# Altium schematic sheet AnalogSigCond1.SchDoc: Analog Signal Front-End 1
size Letter; Engineer: Nathan Petersen; DocumentNumber: 14; Revision: v1.2; SheetNumber: 14; SheetTotal: 30
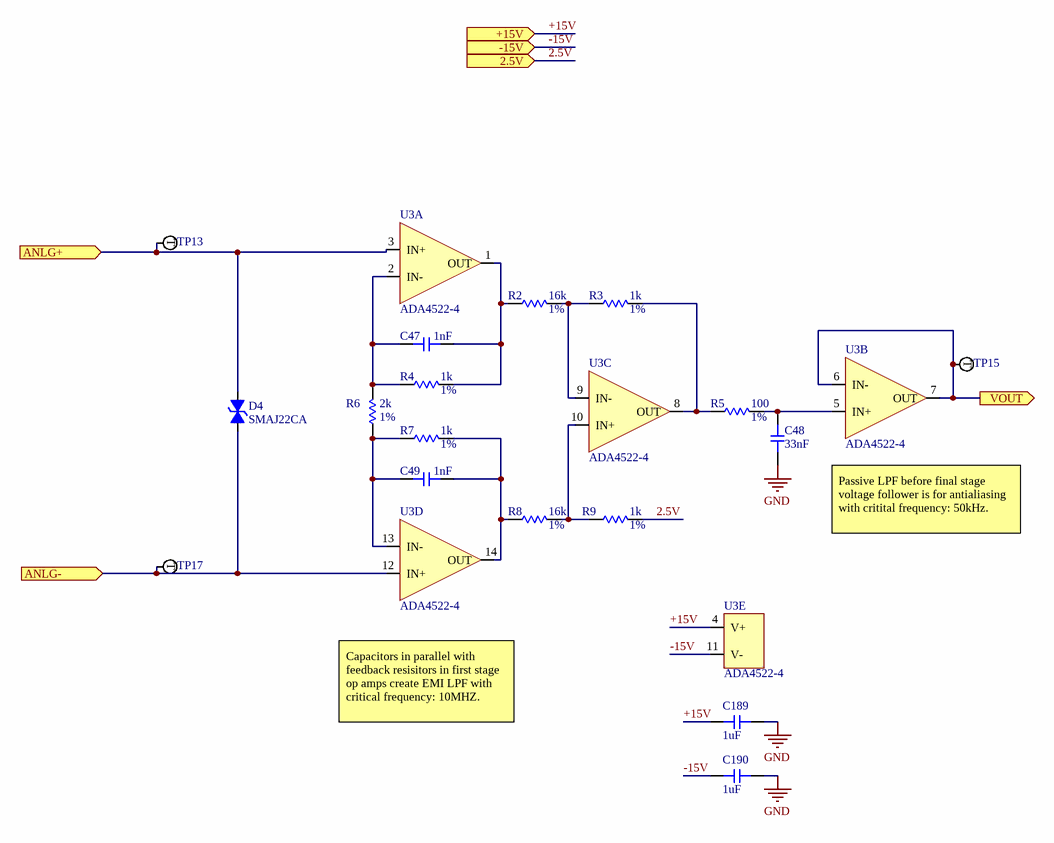
[diagram p0: AnalogSigCond1.SchDoc]

## Parts
C47  Capacitance: 1nF  [0603-CAP]  (hidden comment: Capacitor)
C48  Capacitance: 33nF  [0603-CAP]  (hidden comment: Capacitor)
C49  Capacitance: 1nF  [0603-CAP]  (hidden comment: Capacitor)
C189  value 1uF  [0603-CAP]  (hidden comment: Capacitor)
C190  value 1uF  [0603-CAP]  (hidden comment: Capacitor)
D4  Manufacturer Part Number: SMAJ22CA  [SMA]  (hidden comment: TVS SMAJ22CA)
R2  Resistance: 16k  Tolerance: 1%  [0603-RES]  (hidden comment: Resistor)
R3  Resistance: 1k  Tolerance: 1%  [0603-RES]  (hidden comment: Resistor)
R4  Resistance: 1k  Tolerance: 1%  [0603-RES]  (hidden comment: Resistor)
R5  Resistance: 100  Tolerance: 1%  [0603-RES]  (hidden comment: Resistor)
R6  Resistance: 2k  Tolerance: 1%  [0603-RES]  (hidden comment: Resistor)
R7  Resistance: 1k  Tolerance: 1%  [0603-RES]  (hidden comment: Resistor)
R8  Resistance: 16k  Tolerance: 1%  [0603-RES]  (hidden comment: Resistor)
R9  Resistance: 1k  Tolerance: 1%  [0603-RES]  (hidden comment: Resistor)
TP13  Test Point  [RCU-0C]  (value not drawn)
TP15  Test Point  [RCU-0C]  (value not drawn)
TP17  Test Point  [RCU-0C]  (value not drawn)
U3  ADA4522-4  [TSSOP-14]  (parts A,B,C,D,E of 5)

## Ports
2.5V (in), +15V (in), -15V (in), ANLG+ (in), ANLG- (in), VOUT (out)

## Nets
GND: C48.1 C189.2 C190.2
2.5V: R9.2 ; port 2.5V
+15V: C189.1 U3.4(V+) ; port +15V
-15V: C190.1 U3.11(V-) ; port -15V
ANLG+: D4.2 TP13.1 U3.3(IN+) ; port ANLG+
ANLG-: D4.1 TP17.1 U3.12(IN+) ; port ANLG-
VOUT: TP15.1 U3.6(IN-) U3.7(OUT) ; port VOUT
NetC47_1: C47.1 R4.1 R6.2 U3.2(IN-)
NetC47_2: C47.2 R2.1 R4.2 U3.1(OUT)
NetC48_2: C48.2 R5.2 U3.5(IN+)
NetC49_1: C49.1 R6.1 R7.1 U3.13(IN-)
NetC49_2: C49.2 R7.2 R8.1 U3.14(OUT)
NetR2_2: R2.2 R3.1 U3.9(IN-)
NetR3_2: R3.2 R5.1 U3.8(OUT)
NetR8_2: R8.2 R9.1 U3.10(IN+)

## Notes on the sheet
- Passive LPF before final stage voltage follower is for antialiasing with critital frequency: 50kHz.
- Capacitors in parallel with feedback resisitors in first stage op amps create EMI LPF with critical frequency: 10MHZ.
- Title:
- File:
- Sheet:
- of
- Revision:
- Time:
- Date:
- Engineer:
- (in symbol Test Point) T

## Library data of the parts
C47 C49 = Capacitor: Manufacturer: KEMET; Manufacturer Part Number: C0603C102J5RAC7867; Dielectric Material: Ceramic; Tolerance: 5%; Dielectric: X7R; Voltage Rating (DC): 50V; Supplier 1: Digi-Key; Supplier Part Number 1: 399-1083-6-ND; Stock 1: 40000; Pricing 1: 1=0.1, 10=0.051, 100=0.0225, 500=0.0161, 1000=0.01265 (USD); Mount: Surface Mount; Case/Package: 0603; Min Operating Temperature: -55°C; Max Operating Temperature: 125°C; Packaging: Tape and Reel; Length: 1.6mm; Height: 0.8mm; Depth: 0.8mm; Radiation Hardening: No; ComponentLink1URL: https://datasheet.ciiva.com/45846/docfinderpartnumberc0402c102k5ractu-45846924.pdf; ComponentLink1Description: https://datasheet.ciiva.com/45846/docfinderpartnumberc0402c102k5ractu-45846924.pdf
C48 = Capacitor: Manufacturer: Samsung; Manufacturer Part Number: CL10B333KA8NNNC; Tolerance: 10%; Voltage Rating: 25V; Dielectric: X7R; Supplier 1: Digi-Key; Supplier Part Number 1: 1276-2038-6-ND; Stock 1: 40000; Pricing 1: 1=0.1, 10=0.051, 100=0.0225, 500=0.0161, 1000=0.01265 (USD); Mount: Surface Mount; Case/Package: 0603; Case Code (Metric): 1608; Case Code (Imperial): 0603; Min Operating Temperature: -55°C; Max Operating Temperature: 125°C; Package Quantity: 1; Packaging: Tape and Reel; Voltage Rating (DC): 25V; Length: 1.6mm; Height: 0.8mm; Width: 0.031inch; Thickness: 0.035inch; Depth: 0.8mm; Radiation Hardening: No; Lead Free: Lead Free; ComponentLink1URL: https://datasheet.ciiva.com/25781/cl10b333ka8nnnc-25781520.pdf; ComponentLink1Description: https://datasheet.ciiva.com/25781/cl10b333ka8nnnc-25781520.pdf; ComponentLink2URL: https://datasheet.ciiva.com/16218/cl05b104kq5nnnc-16218987.pdf; ComponentLink2Description: https://datasheet.ciiva.com/16218/cl05b104kq5nnnc-16218987.pdf; ComponentLink3URL: https://datasheet.ciiva.com/26838/getdatasheetpartid-745367-26838459.pdf; ComponentLink3Description: https://datasheet.ciiva.com/26838/getdatasheetpartid-745367-26838459.pdf
C189 C190 = Capacitor: Manufacturer: Samsung; Manufacturer Part Number: CL10B105MO8NNWC; Voltage Rating: 16V; Tolerance: 20%; Supplier 1: Digi-Key; Supplier Part Number 1: 1276-6524-6-ND; Stock 1: 40000; Pricing 1: 1=0.1, 10=0.032, 100=0.0142, 500=0.01016, 1000=0.00798 (USD); Mount: Surface Mount; Case/Package: 0603; Case Code (Metric): 1608; Case Code (Imperial): 0603; Min Operating Temperature: -55°C; Max Operating Temperature: 125°C; Packaging: Tape and Reel; Capacitance: 1uF; Length: 0.063inch; Width: 0.031inch; Thickness: 0.035inch; ComponentLink1URL: http://www.samsungsem.com/kr/support/product-search/mlcc/CL10B105MO8NNWC.jsp; ComponentLink1Description: http://www.samsungsem.com/kr/support/product-search/mlcc/CL10B105MO8NNWC.jsp
D4 = TVS SMAJ22CA: TVS DIODE 22V 35.5V SMA; Manufacturer: Bourns; Direction: Bidirectional; Reverse Breakdown Voltage: 24.4V; Operating Supply Voltage: 3.5V; Max Surge Current: 40A; Number of Bidirectional Channels: 1; Peak Pulse Power: 400W; Power Line Protection: No; Breakdown Voltage: 26.9V; Peak Pulse Current: 11.2A; Test Current: 1mA; Max Reverse Leakage Current: 5uA; Element Configuration: Single; ComponentLink1URL: https://datasheet.ciiva.com/333/smaj-333520.pdf; ComponentLink1Description: https://datasheet.ciiva.com/333/smaj-333520.pdf; ComponentLink2URL: https://datasheet.ciiva.com/3022/smaj-3022225.pdf; ComponentLink2Description: https://datasheet.ciiva.com/3022/smaj-3022225.pdf; ComponentLink3URL: https://datasheet.ciiva.com/17413/smaj-17413512.pdf; ComponentLink3Description: https://datasheet.ciiva.com/17413/smaj-17413512.pdf; ComponentLink4URL: https://datasheet.ciiva.com/4509/smaj-74970-4509930.pdf; ComponentLink4Description: https://datasheet.ciiva.com/4509/smaj-74970-4509930.pdf; ComponentLink5URL: https://datasheet.ciiva.com/333/smaj-333518.pdf; ComponentLink5Description: https://datasheet.ciiva.com/333/smaj-333518.pdf; ComponentLink6URL: https://datasheet.ciiva.com/333/smaj-333519.pdf; ComponentLink6Description: https://datasheet.ciiva.com/333/smaj-333519.pdf; Supplier 1: Digi-Key; Stock 1: 24429; Pricing 1: 1=0.45, 10=0.353, 25=0.2976, 100=0.2421, 250=0.2006, 500=0.16602, 1000=0.12451, 2500=0.11414 (USD); Mount: Surface Mount; Case/Package: SMA; Number of Pins: 2; Min Operating Temperature: -55°C; Max Operating Temperature: 150°C; Packaging: Tape and Reel; Package Quantity: 1; Reverse Standoff Voltage: 22V; Min Breakdown Voltage: 24.4V; Clamping Voltage: 35.5V; Number of Channels: 1; Polarity: Bidirectional; Termination: SMD/SMT; Number of Elements: 1; Leakage Current: 5uA; Composition: Zener; Radiation Hardening: No; ComponentLink7URL: https://datasheet.ciiva.com/3022/smaj-3022227.pdf; ComponentLink7Description: https://datasheet.ciiva.com/3022/smaj-3022227.pdf; ComponentLink8URL: https://datasheet.ciiva.com/3022/smaj-3022228.pdf; ComponentLink8Description: https://datasheet.ciiva.com/3022/smaj-3022228.pdf; ComponentLink9URL: https://datasheet.ciiva.com/334/smaj-334501.pdf; ComponentLink9Description: https://datasheet.ciiva.com/334/smaj-334501.pdf; ComponentLink10URL: https://datasheet.ciiva.com/334/smaj-334502.pdf; ComponentLink10Description: https://datasheet.ciiva.com/334/smaj-334502.pdf; ComponentLink11URL: https://datasheet.ciiva.com/334/smaj-334503.pdf; ComponentLink11Description: https://datasheet.ciiva.com/334/smaj-334503.pdf; Supplier Part Number 1: SMAJ22CABDKR-ND
R2 R8 = Resistor: Manufacturer: Panasonic; Manufacturer Part Number: ERJ-3EKF1602V; Power Rating: 100mW; Voltage Rating: 75V; Temperature Coefficient: 100ppm/°C; Supplier 1: Digi-Key; Supplier Part Number 1: P16.0KHDKR-ND; Stock 1: 80279; Pricing 1: 1=0.1, 10=0.079, 100=0.0323, 1000=0.01449, 2500=0.01258 (USD); Mount: Surface Mount; Case/Package: 0603; Case Code (Imperial): 0603; Case Code (Metric): 1608; Contact Plating: Tin; Min Operating Temperature: -55°C; Max Operating Temperature: 155°C; Packaging: Tape and Reel; Package Quantity: 1; Composition: Thick Film; Number of Terminations: 2; Military Standard: Not; Termination: SMD/SMT; Max Power Dissipation: 100mW; Voltage Rating (DC): 75V; Features: Automotive AEC-Q200; Length: 1.6mm; Height: 0.022inch; Width: 0.8mm; Depth: 0.8mm; Radiation Hardening: No; REACH SVHC: Unknown; Lead Free: Lead Free; ComponentLink1URL: https://datasheet.ciiva.com/28680/1678782-28680759.pdf; ComponentLink1Description: https://datasheet.ciiva.com/28680/1678782-28680759.pdf; ComponentLink2URL: https://datasheet.ciiva.com/16779/70260748-16779769.pdf; ComponentLink2Description: https://datasheet.ciiva.com/16779/70260748-16779769.pdf; ComponentLink3URL: https://datasheet.ciiva.com/30226/aoa0000ce2-30226189.pdf; ComponentLink3Description: https://datasheet.ciiva.com/30226/aoa0000ce2-30226189.pdf; ComponentLink4URL: https://datasheet.ciiva.com/5875/426256-5875646.pdf; ComponentLink4Description: https://datasheet.ciiva.com/5875/426256-5875646.pdf; ComponentLink5URL: https://datasheet.ciiva.com/28515/1678782-28515247.pdf; ComponentLink5Description: https://datasheet.ciiva.com/28515/1678782-28515247.pdf; ComponentLink6URL: https://datasheet.ciiva.com/46378/426256-46378047.pdf; ComponentLink6Description: https://datasheet.ciiva.com/46378/426256-46378047.pdf
R3 R4 R7 R9 = Resistor: Manufacturer: Panasonic; Manufacturer Part Number: ERJ-3EKF1001V; Power Rating: 100mW; Voltage Rating: 75V; Temperature Coefficient: 100ppm/°C; Supplier 1: Digi-Key; Supplier Part Number 1: P1.00KHDKR-ND; Stock 1: 16711563; Pricing 1: 1=0.1, 10=0.079, 100=0.0323, 1000=0.01449, 2500=0.01258 (USD); Mount: Surface Mount; Case/Package: 0603; Number of Pins: 2; Case Code (Metric): 1608; Case Code (Imperial): 0603; Contact Plating: Tin; Min Operating Temperature: -55°C; Max Operating Temperature: 155°C; Packaging: Tape and Reel; Composition: Thick Film; Military Standard: Not; Voltage Rating (DC): 75V; Package Quantity: 1; Number of Terminations: 2; Termination: SMD/SMT; Max Power Dissipation: 100mW; Features: Automotive AEC-Q200; Length: 1.6mm; Height: 0.45mm; Width: 0.031inch; Depth: 0.8mm; Radiation Hardening: No; REACH SVHC: No SVHC; Lead Free: Lead Free; ComponentLink1URL: https://datasheet.ciiva.com/16768/70260748-16768437.pdf; ComponentLink1Description: https://datasheet.ciiva.com/16768/70260748-16768437.pdf; ComponentLink2URL: https://datasheet.ciiva.com/16774/70260748-16774550.pdf; ComponentLink2Description: https://datasheet.ciiva.com/16774/70260748-16774550.pdf; ComponentLink3URL: https://datasheet.ciiva.com/28532/426256-28532120.pdf; ComponentLink3Description: https://datasheet.ciiva.com/28532/426256-28532120.pdf; ComponentLink4URL: https://datasheet.ciiva.com/16449/aoa0000ce2-16449065.pdf; ComponentLink4Description: https://datasheet.ciiva.com/16449/aoa0000ce2-16449065.pdf; ComponentLink5URL: https://datasheet.ciiva.com/7942/aoa0000ce2-7942427.pdf; ComponentLink5Description: https://datasheet.ciiva.com/7942/aoa0000ce2-7942427.pdf; ComponentLink6URL: https://datasheet.ciiva.com/9198/aoa0000ce2-9198923.pdf; ComponentLink6Description: https://datasheet.ciiva.com/9198/aoa0000ce2-9198923.pdf; ComponentLink7URL: https://datasheet.ciiva.com/46373/1678782-46373339.pdf; ComponentLink7Description: https://datasheet.ciiva.com/46373/1678782-46373339.pdf; ComponentLink8URL: https://datasheet.ciiva.com/48530/aoa0000ce2-48530987.pdf; ComponentLink8Description: https://datasheet.ciiva.com/48530/aoa0000ce2-48530987.pdf; ComponentLink9URL: https://datasheet.ciiva.com/46373/1678782-46373340.pdf; ComponentLink9Description: https://datasheet.ciiva.com/46373/1678782-46373340.pdf; ComponentLink10URL: https://datasheet.ciiva.com/24070/aoa0000ce2-24070269.pdf; ComponentLink10Description: https://datasheet.ciiva.com/24070/aoa0000ce2-24070269.pdf; ComponentLink11URL: https://datasheet.ciiva.com/22673/1678782-22673918.pdf; ComponentLink11Description: https://datasheet.ciiva.com/22673/1678782-22673918.pdf; ComponentLink12URL: https://datasheet.ciiva.com/30063/aoa0000ce2-30063390.pdf; ComponentLink12Description: https://datasheet.ciiva.com/30063/aoa0000ce2-30063390.pdf; ComponentLink13URL: https://datasheet.ciiva.com/17215/aoa0000ce2-17215311.pdf; ComponentLink13Description: https://datasheet.ciiva.com/17215/aoa0000ce2-17215311.pdf
R5 = Resistor: Manufacturer: Yageo; Manufacturer Part Number: AC0603FR-07100RL; Power Rating: 100mW; Voltage Rating: 50V; Temperature Coefficient: 100ppm/°C; Supplier 1: Digi-Key; Supplier Part Number 1: YAG3561DKR-ND; Stock 1: 161909; Pricing 1: 1=0.1, 10=0.032, 100=0.0129, 1000=0.00579, 2500=0.00502 (USD); Case/Package: 0603; Weight: 7.1E-05oz; Case Code (Imperial): 0603; Case Code (Metric): 1608; Contact Plating: Tin,Matte; Min Operating Temperature: -55°C; Max Operating Temperature: 155°C; Packaging: Tape and Reel; Composition: Thick Film; Number of Terminations: 2; Termination: SMD/SMT; Military Standard: Not; Max Power Dissipation: 100mW; Length: 1.6mm; Height: 0.022inch; Width: 0.031inch; Depth: 0.8mm; Radiation Hardening: No; Lead Free: Lead Free; ComponentLink1URL: https://datasheet.ciiva.com/12576/pyu-ac-51-rohs-l-2-12576586.pdf; ComponentLink1Description: https://datasheet.ciiva.com/12576/pyu-ac-51-rohs-l-2-12576586.pdf
R6 = Resistor: Manufacturer: Samsung; Manufacturer Part Number: RC1608F202CS; Max Power Dissipation: 100mW; Temperature Coefficient: 100ppm/°C; Voltage Rating (DC): 50V; Supplier 1: Digi-Key; Supplier Part Number 1: 1276-3495-6-ND; Stock 1: 137995; Pricing 1: 1=0.1, 10=0.033, 100=0.0136, 1000=0.00609, 2500=0.00529 (USD); Case/Package: 0603; Case Code (Metric): 1608; Case Code (Imperial): 0603; Contact Plating: Tin; Min Operating Temperature: -55°C; Max Operating Temperature: 155°C; Packaging: Tape and Reel; Composition: Thick Film; Number of Terminations: 2; Military Standard: Not; Length: 0.063inch; Height: 0.022inch; Width: 0.031inch; Depth: 0.8mm; Radiation Hardening: No; Lead Free: Lead Free; ComponentLink1URL: https://datasheet.ciiva.com/26179/chip-resistor-150112-1-26179660.pdf; ComponentLink1Description: https://datasheet.ciiva.com/26179/chip-resistor-150112-1-26179660.pdf; ComponentLink2URL: https://datasheet.ciiva.com/26179/chip-resistor-150112-1-26179645.pdf; ComponentLink2Description: https://datasheet.ciiva.com/26179/chip-resistor-150112-1-26179645.pdf; ComponentLink3URL: https://datasheet.ciiva.com/26179/chip-resistor-150112-1-26179677.pdf; ComponentLink3Description: https://datasheet.ciiva.com/26179/chip-resistor-150112-1-26179677.pdf
TP13 TP15 TP17 = Test Point: Material - Insulation: No Insulation; Supplier Part Number: *; Supplier: *; Footprint: *; Supplier 1: Digi-Key; RoHS: RoHS Compliant; Category: Test and Measurement; Stock 1: 136646; Pricing 1: 1=0.22, 10=0.206, 25=0.1756, 50=0.1536, 100=0.1426, 250=0.12616, 500=0.12068, 1000=0.09874 (USD); Packaging: Cut Tape (CT); Part Status: Active; Type: PC Test Point; Mounting Type: Surface Mount; Color: Natural; Size / Dimension: 0.063" x 0.031" x 0.045" (1.60mm x 0.80mm x 1.15mm); Plating: -; Material - Body: -; ComponentLink1URL: http://www.te.com/commerce/DocumentDelivery/DDEController?Action=srchrtrv&DocNm=1773266&DocType=DS&DocLang=English; ComponentLink1Description: http://www.te.com/commerce/DocumentDelivery/DDEController?Action=srchrtrv&DocNm=1773266&DocType=DS&DocLang=English; Supplier Part Number 1: A106145CT-ND
U3 = ADA4522-4: Manufacturer: Analog Devices; Manufacturer Part Number: ADA4522-4ARUZ-RL; Number of Circuits: 4; Slew Rate: 1.7V/µs; Gain Bandwidth Product: 2.7MHz; Input Bias Current: 50pA; Input Offset Voltage (Vos): 1.5uV; Operating Supply Current: 830uA; Output Current per Channel: 32mA; Max Dual Supply Voltage: 27.5V; Voltage Gain: 137dB; Common Mode Rejection Ratio: 140dB; Power Supply Rejection Ratio (PSRR): 150dB; Min Supply Voltage: 4.5V; Min Dual Supply Voltage: 2.25V; Max Supply Voltage: 55V; Supplier 1: Digi-Key; Supplier Part Number 1: ADA4522-4ARUZ-RLCT-ND; Mount: Surface Mount; Case/Package: TSSOP; Number of Pins: 14; Contact Plating: Tin,Matte; Min Operating Temperature: -40°C; Max Operating Temperature: 125°C; Packaging: Tape and Reel; Lead Free: Contains Lead; ComponentLink1URL: http://www.mouser.com/ds/2/609/ADA4522-1_4522-2_4522-4-914641.pdf; ComponentLink1Description: http://www.mouser.com/ds/2/609/ADA4522-1_4522-2_4522-4-914641.pdf; ComponentLink2URL: http://www.analog.com/media/en/technical-documentation/data-sheets/ADA4522-1_4522-2_4522-4.pdf; ComponentLink2Description: http://www.analog.com/media/en/technical-documentation/data-sheets/ADA4522-1_4522-2_4522-4.pdf; Stock 1: 1071; Pricing 1: 1=8.7, 10=7.861, 100=6.5086, 500=5.66758, 1000=4.93628 (USD)